# EasyEDA Pro project Twinverter_PB_MTE_3.eprj, schematic HV end
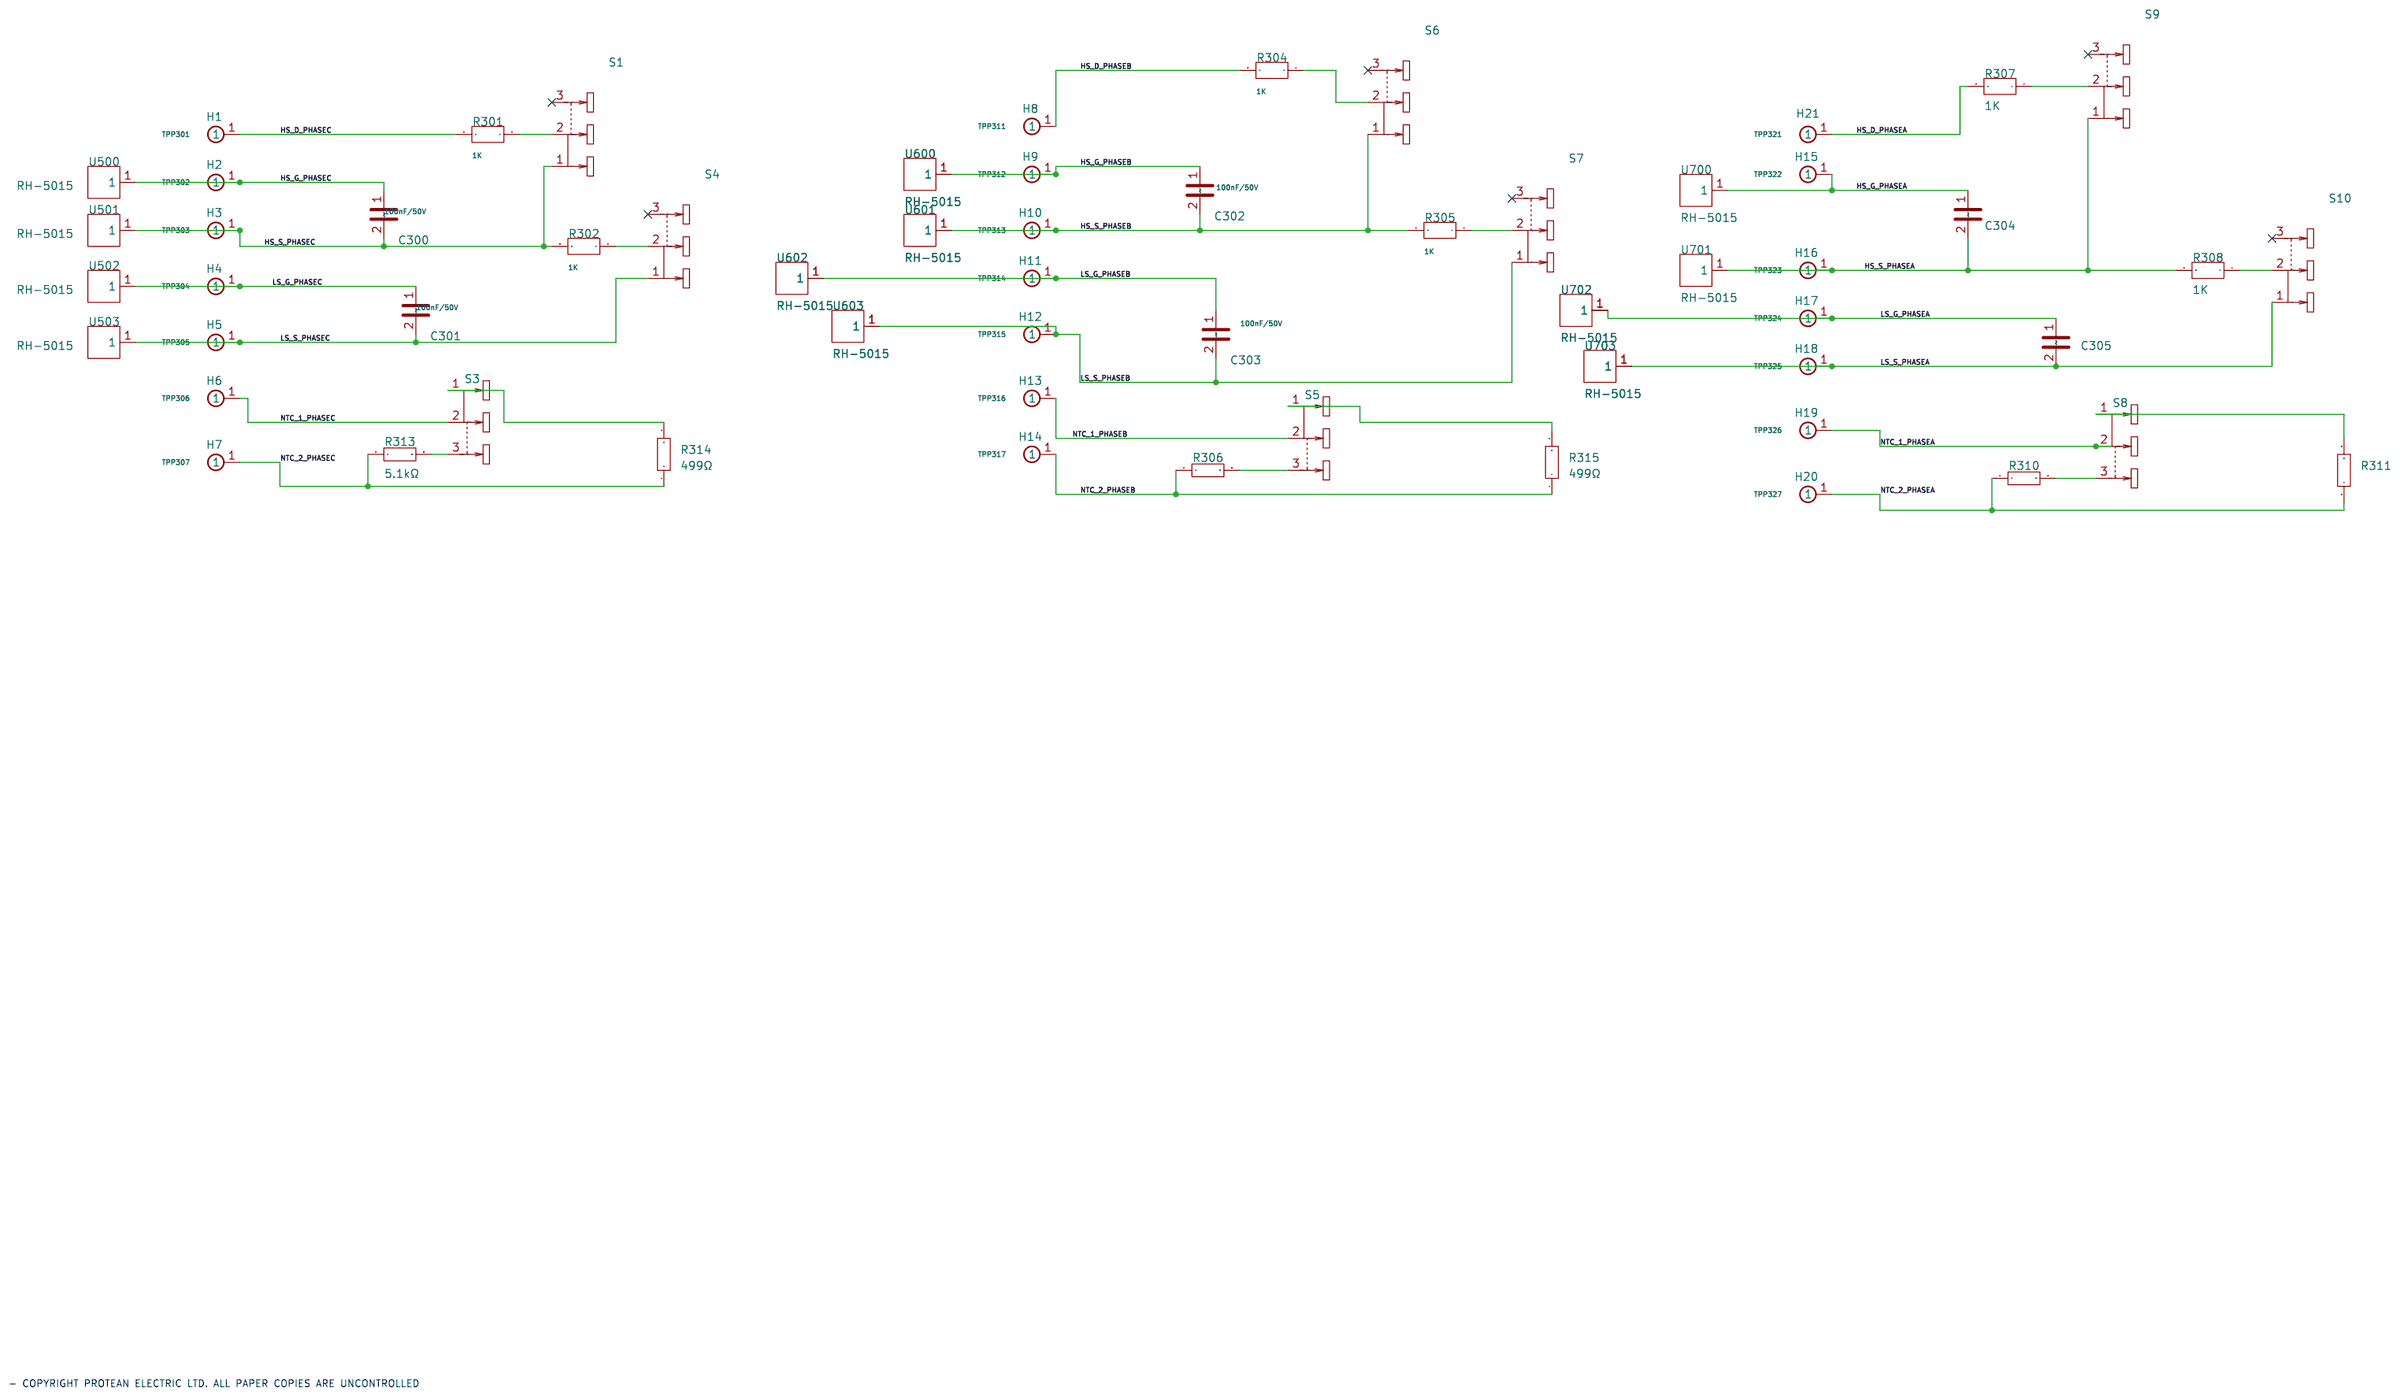
[diagram p0: schematic sheet]

## Parts
C300  100nF/50V  [Capacitor_SMD:C_1206_3216Metric]
C301  100nF/50V  [Capacitor_SMD:C_1206_3216Metric]
C302  100nF/50V  [Capacitor_SMD:C_1206_3216Metric]
C303  100nF/50V  [Capacitor_SMD:C_1206_3216Metric]
C304  100nF/50V  [Capacitor_SMD:C_1206_3216Metric]
C305  100nF/50V  [Capacitor_SMD:C_1206_3216Metric]
H1  TPP301  [TestPoint:TestPoint_THTPad_D4.0mm_Drill2.0mm]  (no BOM)
H2  TPP302  [TestPoint:TestPoint_THTPad_D4.0mm_Drill2.0mm]  (no BOM)
H3  TPP303  [TestPoint:TestPoint_THTPad_D4.0mm_Drill2.0mm]  (no BOM)
H4  TPP304  [TestPoint:TestPoint_THTPad_D4.0mm_Drill2.0mm]  (no BOM)
H5  TPP305  [TestPoint:TestPoint_THTPad_D4.0mm_Drill2.0mm]  (no BOM)
H6  TPP306  [TestPoint:TestPoint_THTPad_D4.0mm_Drill2.0mm]  (no BOM)
H7  TPP307  [TestPoint:TestPoint_THTPad_D4.0mm_Drill2.0mm]  (no BOM)
H8  TPP311  [TestPoint:TestPoint_THTPad_D4.0mm_Drill2.0mm]  (no BOM)
H9  TPP312  [TestPoint:TestPoint_THTPad_D4.0mm_Drill2.0mm]  (no BOM)
H10  TPP313  [TestPoint:TestPoint_THTPad_D4.0mm_Drill2.0mm]  (no BOM)
H11  TPP314  [TestPoint:TestPoint_THTPad_D4.0mm_Drill2.0mm]  (no BOM)
H12  TPP315  [TestPoint:TestPoint_THTPad_D4.0mm_Drill2.0mm]  (no BOM)
H13  TPP316  [TestPoint:TestPoint_THTPad_D4.0mm_Drill2.0mm]  (no BOM)
H14  TPP317  [TestPoint:TestPoint_THTPad_D4.0mm_Drill2.0mm]  (no BOM)
H15  TPP322  [TestPoint:TestPoint_THTPad_D4.0mm_Drill2.0mm]  (no BOM)
H16  TPP323  [TestPoint:TestPoint_THTPad_D4.0mm_Drill2.0mm]  (no BOM)
H17  TPP324  [TestPoint:TestPoint_THTPad_D4.0mm_Drill2.0mm]  (no BOM)
H18  TPP325  [TestPoint:TestPoint_THTPad_D4.0mm_Drill2.0mm]  (no BOM)
H19  TPP326  [TestPoint:TestPoint_THTPad_D4.0mm_Drill2.0mm]  (no BOM)
H20  TPP327  [TestPoint:TestPoint_THTPad_D4.0mm_Drill2.0mm]  (no BOM)
H21  TPP321  [TestPoint:TestPoint_THTPad_D4.0mm_Drill2.0mm]  (no BOM)
R301  1K  [Resistor_SMD:R_1206_3216Metric_Pad1.30x1.75mm_HandSolder]
R302  1K  [Resistor_SMD:R_1206_3216Metric_Pad1.30x1.75mm_HandSolder]
R304  1K  [Resistor_SMD:R_1206_3216Metric_Pad1.30x1.75mm_HandSolder]
R305  1K  [Resistor_SMD:R_1206_3216Metric_Pad1.30x1.75mm_HandSolder]
R306  5.1kΩ  [R1206]
R307  1K  [Resistor_SMD:R_1206_3216Metric_Pad1.30x1.75mm_HandSolder]
R308  1K  [Resistor_SMD:R_1206_3216Metric_Pad1.30x1.75mm_HandSolder]
R310  5.1kΩ  [R1206]
R311  499Ω  [R1206]
R313  5.1kΩ  [R1206]
R314  499Ω  [R1206]
R315  499Ω  [R1206]
S1  JS102011JCQN  [SamacSys_Parts:JS102011JCQN]
S3  JS102011JCQN  [SamacSys_Parts:JS102011JCQN]
S4  JS102011JCQN  [SamacSys_Parts:JS102011JCQN]
S5  JS102011JCQN  [SamacSys_Parts:JS102011JCQN]
S6  JS102011JCQN  [SamacSys_Parts:JS102011JCQN]
S7  JS102011JCQN  [SamacSys_Parts:JS102011JCQN]
S8  JS102011JCQN  [SamacSys_Parts:JS102011JCQN]
S9  JS102011JCQN  [SamacSys_Parts:JS102011JCQN]
S10  JS102011JCQN  [SamacSys_Parts:JS102011JCQN]
U500  RH-5015  [SMD_RH-5015]
U501  RH-5015  [SMD_RH-5015]
U502  RH-5015  [SMD_RH-5015]
U503  RH-5015  [SMD_RH-5015]
U600  RH-5015  [SMD_RH-5015]
U601  RH-5015  [SMD_RH-5015]
U602  RH-5015  [SMD_RH-5015]
U603  RH-5015  [SMD_RH-5015]
U700  RH-5015  [SMD_RH-5015]
U701  RH-5015  [SMD_RH-5015]
U702  RH-5015  [SMD_RH-5015]
U703  RH-5015  [SMD_RH-5015]

## Library data of the parts
C300-C305 = Device_C: Unpolarized capacitor; Users: REF**; PROTEAN PART NO: P1320287; ALTIUM_VALUE: 100nF; FOOTPRINT/PACKAGE: 0805; VOLTAGE: 50V; COMPONENT HEIGHT: 1.25mm; MATERIAL: C0G; TOLERANCE: 5%; RATING: -55 to 125degC; MANUFACTURER: TDK; MFR PART NO: CGA4J2C0G1H333J125AE; VOLUME PRICE: $0.073; ADDED: SA 24/04/2023; SUPPLIER: Mouser; SUP PART NO: 810-CGA4J2CG1H333J12; AEC: Yes; CLASSIFICATION: 1; VOL DATE-REF: 100K 24/04/2023
H1-H21 = Mechanical_MountingHole_Pad: Mounting Hole with connection; Users: REF**; Check: false
R301 R302 R304 R305 R307 R308 = Device_R: Resistor; Users: REF**; datasheet: #file:///S~{:}HardwareEngineerin~{g}Datasheet~{s}Visha~{y}CRCW_SMT_RES.pdf#; protean part no: P1450330; footprint/package: 1206; component height: 0.65mm; material: TF; tolerance: 1%; voltage: 200V; rating: 0.25W; manufacturer: VISHAY; mfr part no: CRCW12061K00FK; volume price: 0.00611; vol date-ref: 10K 08-01-14; added: NV/11-09-12; supplier: Digikey; sup part no: 541-1.00KFTR-ND; aec: Yes; classification: 1
R306 R310 R313 = RC1206FR-075K1L: LCSC Part Name: 5.1kΩ ±1%; Supplier Part: C163372; Manufacturer: YAGEO(国巨); Supplier Footprint: 1206; JLCPCB Part Class: Extended Part; Datasheet: https://atta.szlcsc.com/upload/public/pdf/source/20180111/C163372_15156543766541258893.pdf; Supplier: LCSC; Tolerance: ±1%; Power(Watts): 250mW; Temperature Coefficient: ±100ppm/℃; Overload Voltage (Max): 200V; Operating Temperature Range: -55℃~+155℃
R311 R314 R315 = 1206W4F4990T5E: LCSC Part Name: 499Ω ±1% 250mW; Supplier Part: C18016; Manufacturer: UNI-ROYAL(厚声); Supplier Footprint: 1206; JLCPCB Part Class: Extended Part; Datasheet: https://atta.szlcsc.com/upload/public/pdf/source/20200306/C422600_1E6D84923E4A46A82E41ADD87F860B5C.pdf; Supplier: LCSC; Type: 厚膜电阻; Tolerance: ±1%; Power(Watts): 250mW; Temperature Coefficient: ±100ppm/℃; Overload Voltage (Max): 200V; Operating Temperature Range: -55℃~+155℃
S1 S3-S10 = SamacSys_Parts_JS102011JCQN: Slide Switches .3A 6VDC SPDT VERT MNT SMT J BEND; Users: REF**; datasheet: https://www.ckswitches.com/media/1422/js.pdf; height: 3; manufacturer_name: C & K COMPONENTS; mouser part number: 611-JS102011JCQN; mouser price/stock: https://www.mouser.co.uk/ProductDetail/CK/JS102011JCQN?qs=74EMXstkWMWQs9mNwlyl0g%3D%3D; arrow price/stock: https://www.arrow.com/en/products/js102011jcqn/ck?utm_currency=USD&region=nac; User doc link: https://www.ckswitches.com/media/1422/js.pdf
U500-U503 U600-U603 U700-U703 = RH-5015: LCSC Part Name: PCB电路板测试点/测试针; Supplier Part: C5199798; Manufacturer: 荣和; JLCPCB Part Class: Extended Part; Datasheet: https://atta.szlcsc.com/upload/public/pdf/source/20231026/DF0E995FBD7BB891A195515CC364B170.pdf; Supplier: LCSC; Connector Type: 铁环型(贴片); Plastic Color: 无塑胶; Board Space (Diameter φ/ Length x Width): 2.67mmx1.02mm

## Nets
HS_D_PHASEA: H21.1 R307.2
HS_D_PHASEB: H8.1 R304.2
HS_D_PHASEC: H1.1 R301.2
HS_G_PHASEA: C304.1 H15.1 U700.1
HS_G_PHASEB: C302.1 H9.1 U600.1
HS_G_PHASEC: C300.1 H2.1 U500.1
HS_S_PHASEA: C304.2 H16.1 R308.2 S9.1 U701.1
HS_S_PHASEB: C302.2 H10.1 R305.2 S6.1 U601.1
HS_S_PHASEC: C300.2 H3.1 R302.2 S1.1 U501.1
LS_G_PHASEA: C305.1 H17.1 U702.1
LS_G_PHASEB: C303.1 H11.1 U602.1
LS_G_PHASEC: C301.1 H4.1 U502.1
LS_S_PHASEA: C305.2 H18.1 S10.1 U703.1
LS_S_PHASEB: C303.2 H12.1 S7.1 U603.1
LS_S_PHASEC: C301.2 H5.1 S4.1 U503.1
NTC_1_PHASEA: H19.1 S8.2
NTC_1_PHASEB: H13.1 S5.2
NTC_1_PHASEC: H6.1 S3.2
NTC_2_PHASEA: H20.1 R310.1 R311.1
NTC_2_PHASEB: H14.1 R306.1 R315.1
NTC_2_PHASEC: H7.1 R313.1 R314.1
Net-(R301-1): R301.1 S1.2
Net-(R302-1): R302.1 S4.2
Net-(R304-1): R304.1 S6.2
Net-(R305-1): R305.1 S7.2
Net-(R306-2): R306.2 S5.3
Net-(R307-1): R307.1 S9.2
Net-(R308-1): R308.1 S10.2
Net-(R310-2): R310.2 S8.3
Net-(R311-2): R311.2 S8.1
Net-(R313-2): R313.2 S3.3
Net-(R314-2): R314.2 S3.1
Net-(R315-2): R315.2 S5.1

Not connected (* = marked no-connect by the designer): S1 3*; S4 3*; S6 3*; S7 3*; S9 3*; S10 3*

## Notes on the sheet
- - COPYRIGHT PROTEAN ELECTRIC LTD. ALL PAPER COPIES ARE UNCONTROLLED
